# Altium schematic sheet BMS_MCU.SchDoc: MCU
size A2; CompanyName: TAISAT; DrawnBy: Alperen Fenerci; Organization: GREENGUARD; SheetNumber: 2; SheetTotal: 2
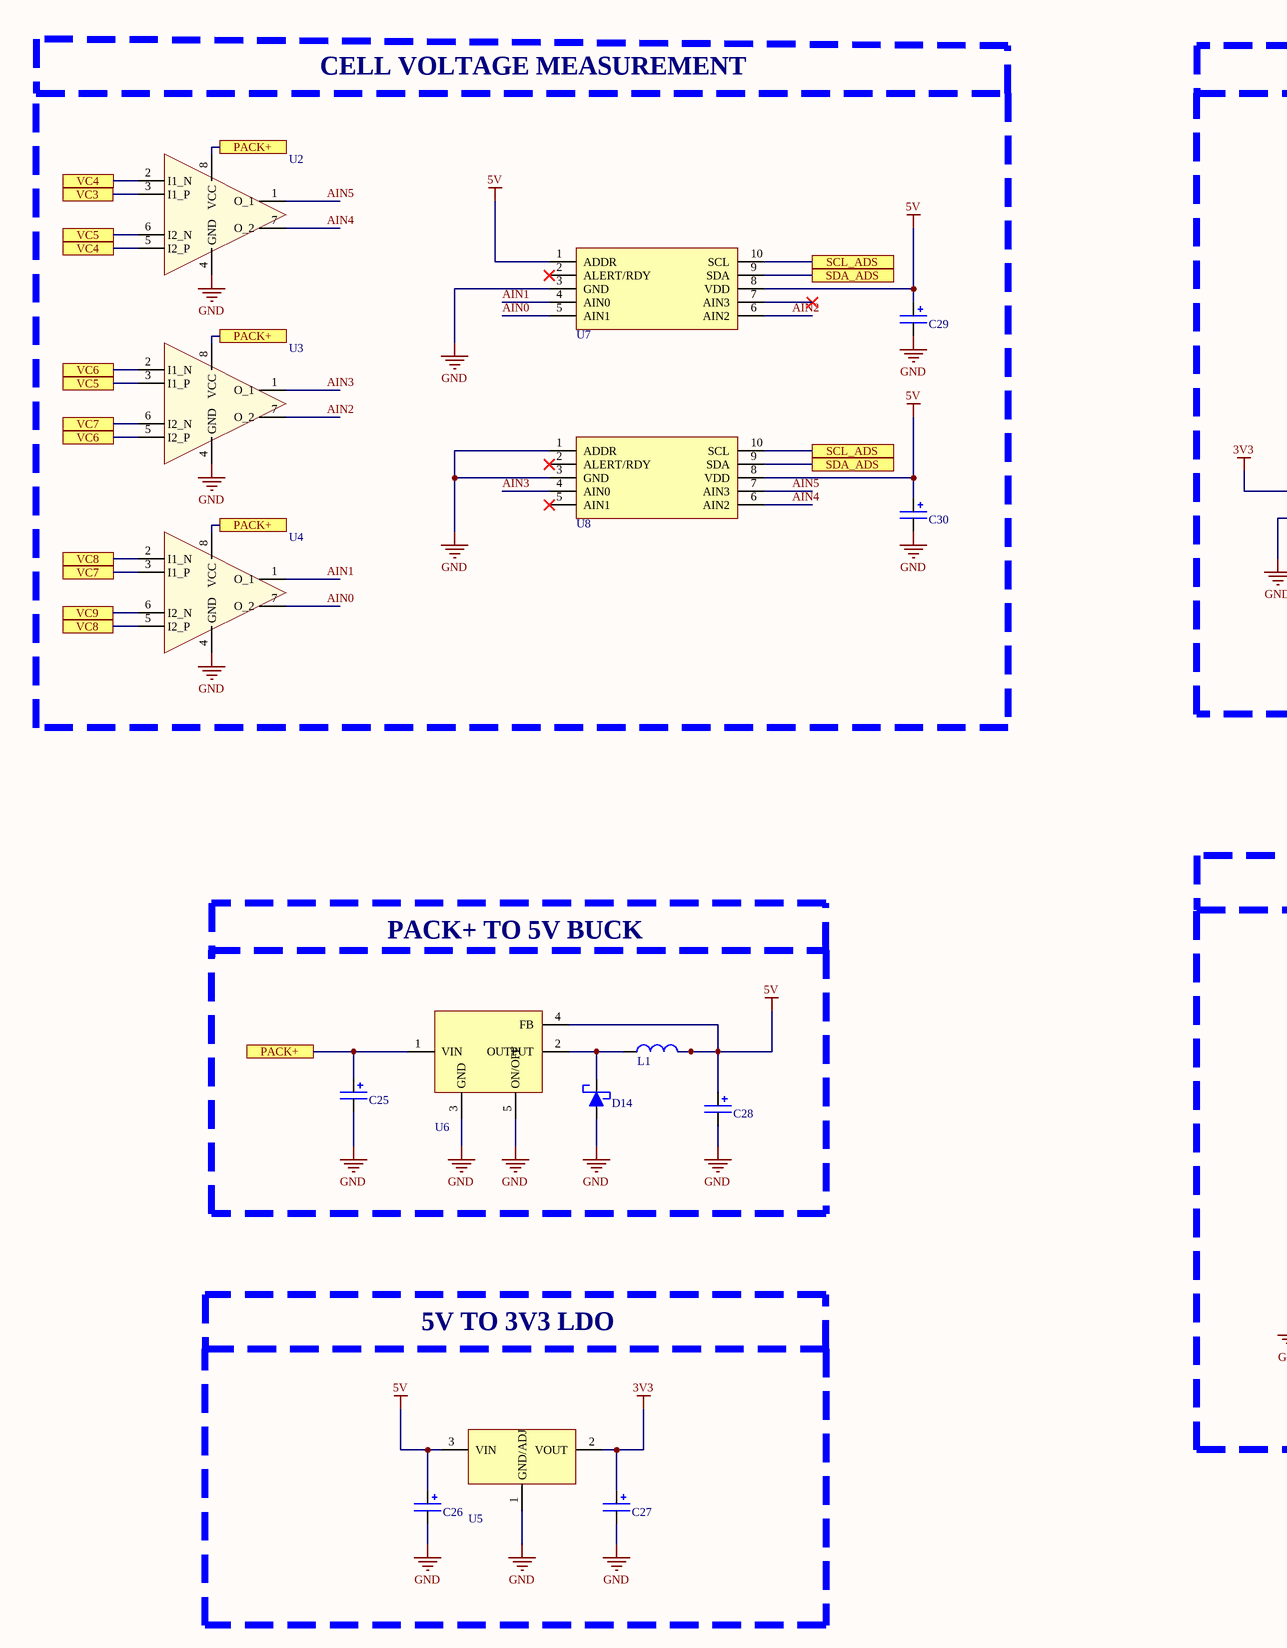
[diagram p0: BMS_MCU.SchDoc, left]
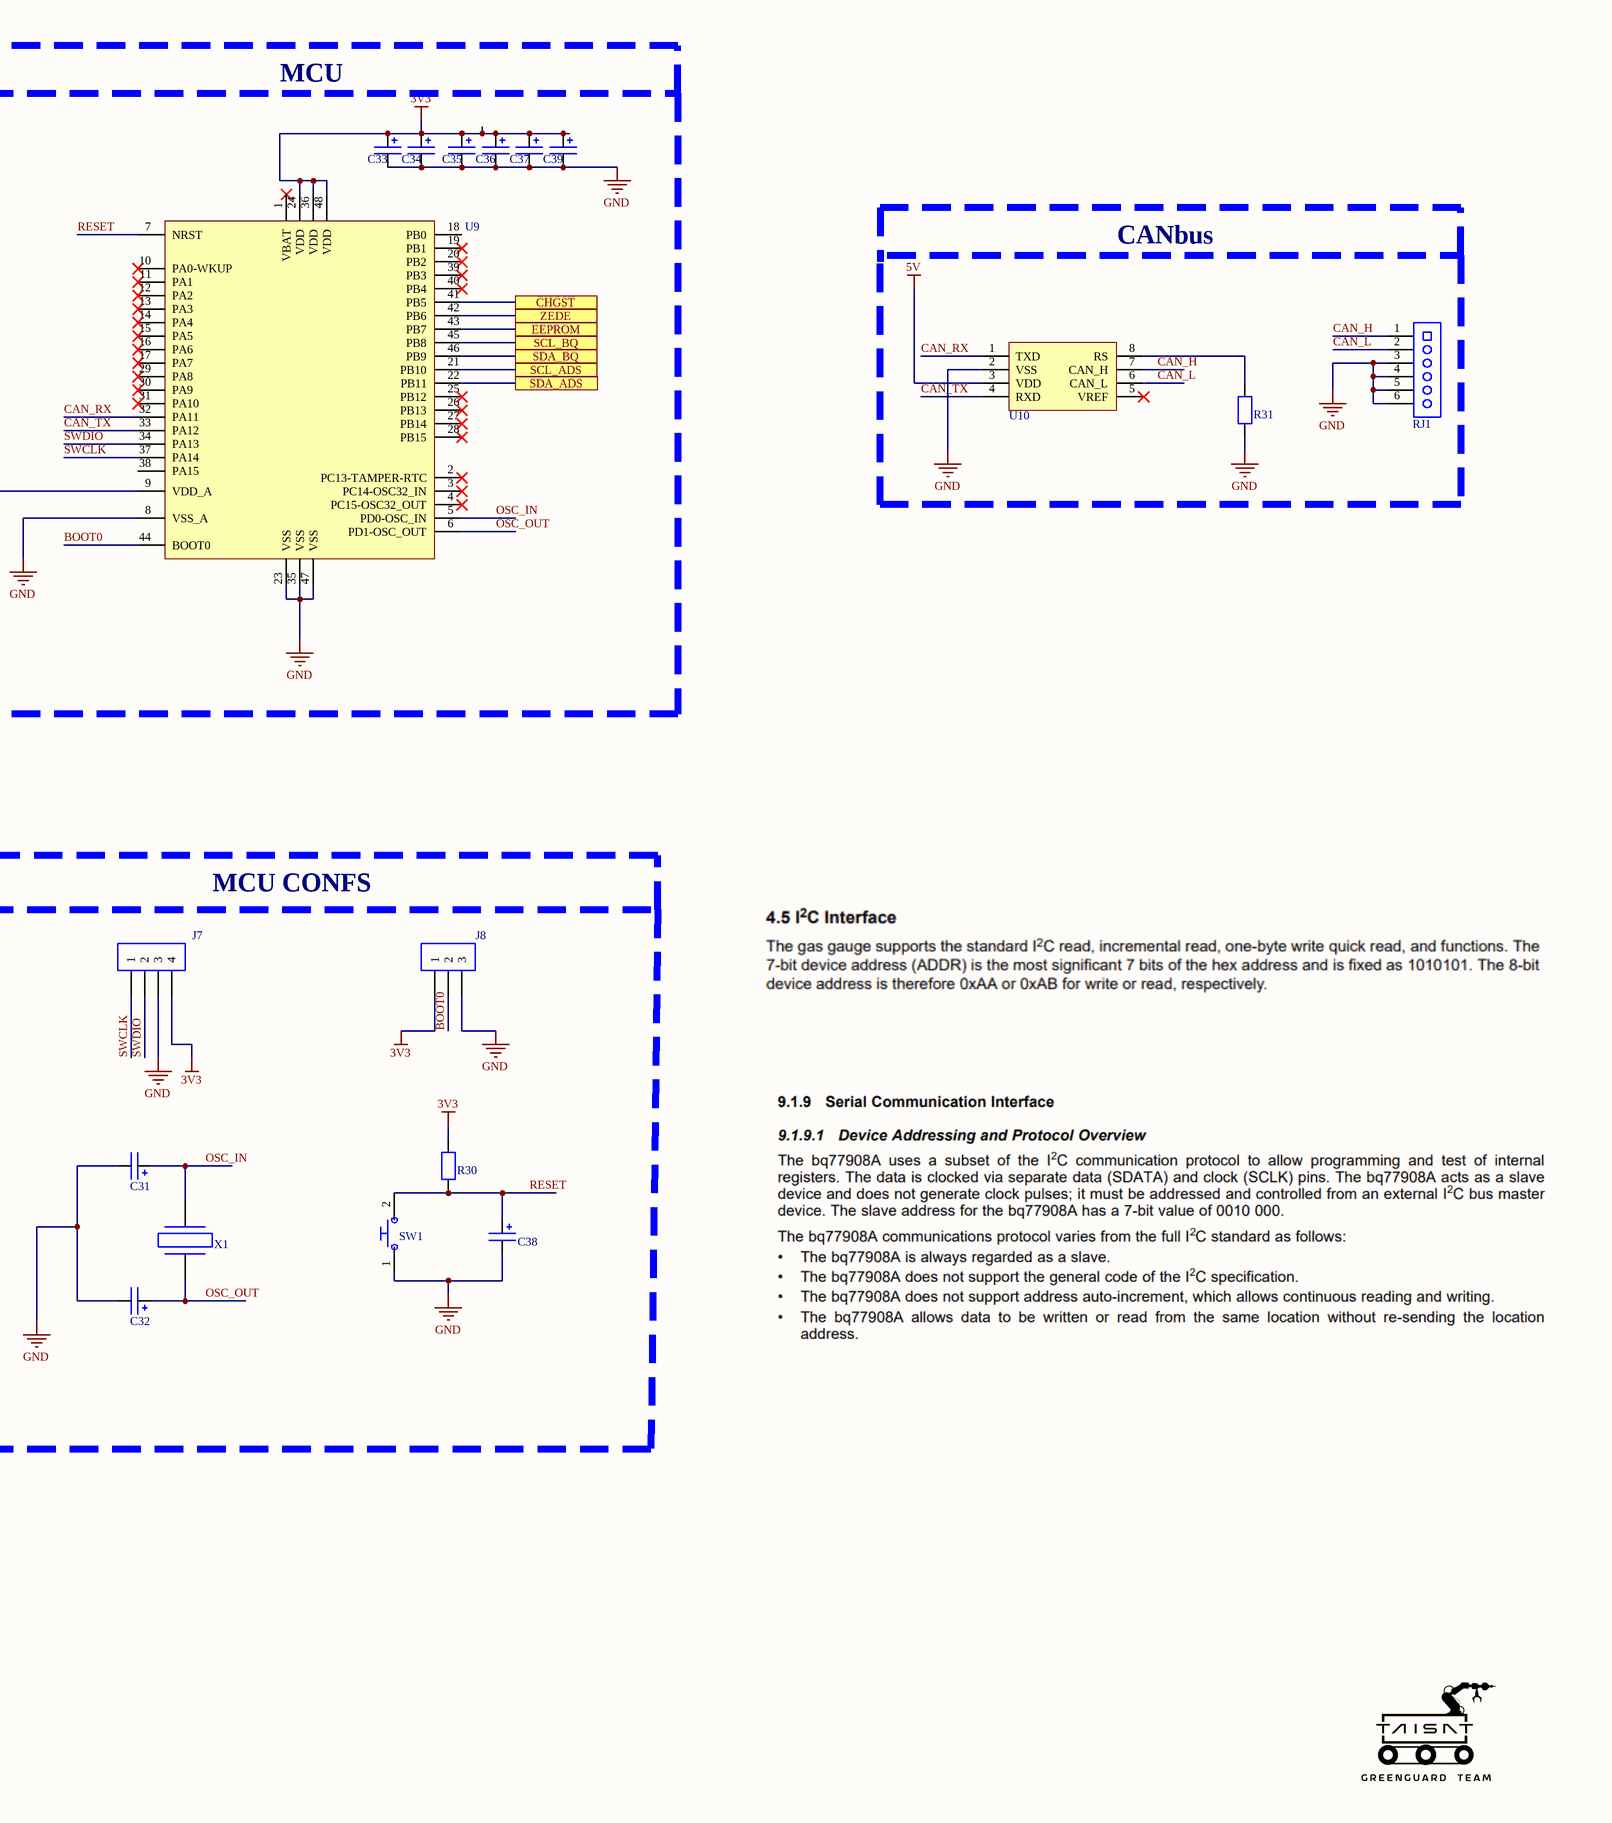
[diagram p1: BMS_MCU.SchDoc, right]

## Parts
C25  100uF  [CAP 0603]  (value not drawn)
C26  100nF  [CAP 0603]  (value not drawn)
C27  22uF  [CAP 0603]  (value not drawn)
C28  330uF  [CAP 0603]  (value not drawn)
C29  0.1uF  [CAP 0603]  (value not drawn)
C30  0.1uF  [CAP 0603]  (value not drawn)
C31  0.1uF  [CAP 0603]  (value not drawn)
C32  0.1uF  [CAP 0603]  (value not drawn)
C33  0.1uF  [CAP 0603]  (value not drawn)
C34  0.1uF  [CAP 0603]  (value not drawn)
C35  0.1uF  [CAP 0603]  (value not drawn)
C36  0.1uF  [CAP 0603]  (value not drawn)
C37  0.1uF  [CAP 0603]  (value not drawn)
C38  0.1uF  [CAP 0603]  (value not drawn)
C39  0.1uF  [CAP 0603]  (value not drawn)
D14  1N5819HW-7-F  [SOD123]  (value not drawn)
J7  146285-4  [HEADER 1x4]  (value not drawn)
J8  146285-3  [HEADER 1x3]  (value not drawn)
L1  330uH  [INDUCTOR SMD]  (value not drawn)
R30  1K  [RESISTOR 0603]  (value not drawn)
R31  10K  [RESISTOR 0603]  (value not drawn)
RJ1  DS1133-03-S60BX  [RJ11,RJ12,RJ14,RJ25]  (value not drawn)
SW1  DTSMF-31R  [SWITCH 6.00 x 3.5 - 2]  (value not drawn)
U2  TL3472CDR  [SOIC-8]  (value not drawn)
U3  TL3472CDR  [SOIC-8]  (value not drawn)
U4  TL3472CDR  [SOIC-8]  (value not drawn)
U5  AMS1117-3V3  [SOT223-3]  (value not drawn)
U6  LM2575-5V  [D2PAK-5]  (value not drawn)
U7  ADS1015  [VSSOP-10]  (value not drawn)
U8  ADS1015  [VSSOP-10]  (value not drawn)
U9  STM32F103x8  [LQFP48]  (value not drawn)
U10  MCP2551T-I  [SOIC-8]  (value not drawn)
X1  CRYSTAL  [CRYSTAL THT]  (value not drawn)

## Ports
CHGST (see BMS_Cell[4B]), EEPROM (see BMS_Cell[5B]), PACK+ (see BMS_Cell[2A], BMS_Cell[4A], BMS_Cell[7C], BMS_Cell[7D], BMS_MCU[1A], BMS_MCU[1B]), PACK+ (see BMS_Cell[2A], BMS_Cell[4A], BMS_Cell[7C], BMS_Cell[7D], BMS_MCU[1A], BMS_MCU[1B], BMS_MCU[1C]), PACK+ (see BMS_Cell[2A], BMS_Cell[4A], BMS_Cell[7C], BMS_Cell[7D], BMS_MCU[1A], BMS_MCU[1C]), SCL_ADS (see BMS_MCU[3A], BMS_MCU[3B]), SCL_ADS (see BMS_MCU[3A], BMS_MCU[6A]), SCL_ADS (see BMS_MCU[3B], BMS_MCU[6A]), SCL_BQ (see BMS_Cell[5B]), SDA_ADS (see BMS_MCU[3A], BMS_MCU[3B]), SDA_ADS (see BMS_MCU[3A], BMS_MCU[6A]), SDA_ADS (see BMS_MCU[3B], BMS_MCU[6A]), SDA_BQ (see BMS_Cell[5B]), VC3 (see BMS_Cell[3A]), VC4 (see BMS_Cell[3A], BMS_MCU[1A]), VC5 (see BMS_Cell[3A], BMS_MCU[1A]), VC6 (see BMS_Cell[3A], BMS_MCU[1A]), VC6 (see BMS_Cell[3A], BMS_MCU[1B]), VC7 (see BMS_Cell[3A], BMS_MCU[1B]), VC8 (see BMS_Cell[3A], BMS_MCU[1B]), VC9 (see BMS_Cell[2B]), ZEDE (see BMS_Cell[5B])

## Nets
3V3: C27.1 C33.1 C34.1 C35.1 C36.1 C37.1 C39.1 J7.4 J8.1 R30.2 U5.2(VOUT) U9.9(VDD_A) U9.24(VDD) U9.36(VDD) U9.48(VDD)
5V: C26.1 C28.1 C29.1 C30.1 L1.2 U5.3(VIN) U6.4(FB) U7.1(ADDR) U7.8(VDD) U8.8(VDD) U10.3(VDD)
GND: C25.2 C26.2 C27.2 C28.2 C29.2 C30.2 C31.2 C32.2 C33.2 C34.2 C35.2 C36.2 C37.2 C38.2 C39.2 D14.2 J7.3 J8.3 R31.1 RJ1.3 RJ1.4 RJ1.5 RJ1.6 SW1.1 U2.4(GND) U3.4(GND) U4.4(GND) U5.1(GND/ADJ) U6.3(GND) U6.5(ON/OFF) U7.3(GND) U8.1(ADDR) U8.3(GND) U9.8(VSS_A) U9.23(VSS) U9.35(VSS) U9.47(VSS) U10.2(VSS)
AIN0: U4.7(O_2) U7.5(AIN1)
AIN1: U4.1(O_1) U7.4(AIN0)
AIN2: U3.7(O_2) U7.6(AIN2)
AIN3: U3.1(O_1) U8.4(AIN0)
AIN4: U2.7(O_2) U8.6(AIN2)
AIN5: U2.1(O_1) U8.7(AIN3)
BOOT0: J8.2 U9.44(BOOT0)
CAN_H: RJ1.1 U10.7(CAN_H)
CAN_L: RJ1.2 U10.6(CAN_L)
CAN_RX: U9.32(PA11) U10.1(TXD)
CAN_TX: U9.33(PA12) U10.4(RXD)
CHGST: U9.41(PB5) ; port CHGST
EEPROM: U9.43(PB7) ; port EEPROM
OSC_IN: C31.1 U9.5(PD0-OSC_IN) X1.1
OSC_OUT: C32.1 U9.6(PD1-OSC_OUT) X1.2
PACK+: C25.1 U2.8(VCC) U3.8(VCC) U4.8(VCC) U6.1(VIN) ; port PACK+
RESET: C38.1 R30.1 SW1.2 U9.7(NRST)
SCL_ADS: U7.10(SCL) U8.10(SCL) U9.21(PB10) ; port SCL_ADS
SCL_BQ: U9.45(PB8) ; port SCL_BQ
SDA_ADS: U7.9(SDA) U8.9(SDA) U9.22(PB11) ; port SDA_ADS
SDA_BQ: U9.46(PB9) ; port SDA_BQ
SWCLK: J7.1 U9.37(PA14)
SWDIO: J7.2 U9.34(PA13)
VC3: U2.3(I1_P) ; port VC3
VC4: U2.2(I1_N) U2.5(I2_P) ; port VC4
VC5: U2.6(I2_N) U3.3(I1_P) ; port VC5
VC6: U3.2(I1_N) U3.5(I2_P) ; port VC6
VC7: U3.6(I2_N) U4.3(I1_P) ; port VC7
VC8: U4.2(I1_N) U4.5(I2_P) ; port VC8
VC9: U4.6(I2_N) ; port VC9
ZEDE: U9.42(PB6) ; port ZEDE
NetD14_1: D14.1 L1.1 U6.2(OUTPUT)
NetR31_2: R31.2 U10.8(RS)

Not connected (* = marked no-connect by the designer): U7 2(ALERT/RDY)* 7(AIN3)*; U8 2(ALERT/RDY)* 5(AIN1)*; U9 1(VBAT)* 2(PC13-TAMPER-RTC)* 3(PC14-OSC32_IN)* 4(PC15-OSC32_OUT)* 10(PA0-WKUP)* 11(PA1)* 12(PA2)* 13(PA3)* 14(PA4)* 15(PA5)* 16(PA6)* 17(PA7)* 18(PB0) 19(PB1)* 20(PB2)* 25(PB12)* 26(PB13)* 27(PB14)* 28(PB15)* 29(PA8)* 30(PA9)* 31(PA10)* 38(PA15) 39(PB3)* 40(PB4)*; U10 5(VREF)*

## Notes on the sheet
- CELL VOLTAGE MEASUREMENT
- MCU
- CANbus
- PACK+ TO 5V BUCK
- MCU CONFS
- 5V TO 3V3 LDO
- Proje Adı / Project Name
- Dosya Adı / File Name
- Sayfa Adı / Sheet Name
- Şirket Adı / Company Name
- Tasarlayan / Designed By
- Takım / Team
- Kontrol Eden / Checked By
- Başlangıç Tarihi / Start Date
- Revize Tarihi / Revision Date
- Onaylayan / Approved By
- Sayfa / Sheet

## Library data of the parts
C25-C39 = CAP 0603: Multilayer Ceramic Capacitor; Manufacturer: KEMET; Manufacturer Part Number: C0603C103K5RACTU; Material: 4241ConductorMaterial; Value: 10nF; Tolerance: 10%; Voltage Rating: 50V; Dielectric: X7R; Dissipation Factor: 2.5%; Temperature Coefficient: 30ppm/°C; Supplier: Mouser; Supplier Part Number: 80-C0603C103K5R; RoHS: Yes; Category: Ceramic Capacitors; Stock: 1110922; Pricing: 1=0.1, 10=0.047, 50=0.047, 100=0.026, 1000=0.017, 10000=0.012 (USD); Mounting Technology: PCB,Surface Mount; Case/Package: 0603; Pins: 2; Case Code (Metric): 1608; Case Code (Imperial): 0603; Min Operating Temperature: -55°C; Max Operating Temperature: 125°C; Voltage Rating (DC): 50V; Packaging: Tape and Reel; Package Quantity: 4000; Termination: SMD/SMT; Series: C0603C; Construction: Flat; Voltage: 50V; Length: 1.6mm; Width: 0.8mm; Height: 0.8mm; Depth: 0.8mm; Lead Pitch: 0.7mm; Radiation Hardening: No; RoHS Compliant: Yes; Reach SVHC Compliant: No; Lead Free: 5697LeadFree; Created By: Kaptanyum
D14 = 1N5819HW-7-F: Diode Schottky 40V; Manufacturer: Diodes; Forward Current: 1A; Max Reverse Current: 50uA; Peak Non-Repetitive Surge Current: 25A; Forward Voltage: 450mV; Polarity: Standard; Max Power Dissipation: 450mW; Supplier: Future Electronics; Supplier Part Number: 5349287; Manufacturer Part Number: 1N5819HW-7-F; RoHS: Yes; Category: Rectifier Diodes; Stock: 3234000; Pricing: 3000=0.0539, 12000=0.0516, 30000=0.0488, 45000=0.0495, 75000=0.0487, 120000=0.0453, 150000=0.0462 (USD); Case/Package: SOD-123-2; Pins: 2; Weight: 0.000353oz; Min Operating Temperature: -65°C; Max Operating Temperature: 125°C; Max Repetitive Reverse Voltage (Vrrm): 40V; Package Quantity: 3000; Packaging: Tape and Reel; Average Rectified Current: 1A; Max Forward Surge Current (Ifsm): 25A; Termination: SMD/SMT; Voltage Rating (DC): 40V; Current Rating: 1A; Output Current: 1A; Max Reverse Voltage (DC): 40V; Series: -; Reverse Voltage: 40V; Length: 2.85mm; Width: 1.7mm; Height: 1.25mm; Radiation Hardening: No; RoHS Compliant: Yes; Lead Free: Lead Free; Reach SVHC Compliant: No; ComponentLink1URL: https://datasheet.ciiva.com/27092/1538419-27092484.pdf?src-supplier=Jameco; ComponentLink1Description: https://datasheet.ciiva.com/27092/1538419-27092484.pdf?src-supplier=Jameco; ComponentLink2URL: https://datasheet.ciiva.com/16303/ds30217-16303296.pdf?src-supplier=Future+Electronics; ComponentLink2Description: https://datasheet.ciiva.com/16303/ds30217-16303296.pdf?src-supplier=Future+Electronics; ComponentLink3URL: https://datasheet.ciiva.com/8303/ds30217-8303132.pdf?src-supplier=Avnet; ComponentLink3Description: https://datasheet.ciiva.com/8303/ds30217-8303132.pdf?src-supplier=Avnet; ComponentLink4URL: https://datasheet.ciiva.com/912/ds30217-912802.pdf?src-supplier=Digi-Key; ComponentLink4Description: https://datasheet.ciiva.com/912/ds30217-912802.pdf?src-supplier=Digi-Key; ComponentLink5URL: https://datasheet.ciiva.com/912/ds30217-912803.pdf?src-supplier=Digi-Key; ComponentLink5Description: https://datasheet.ciiva.com/912/ds30217-912803.pdf?src-supplier=Digi-Key; ComponentLink6URL: https://datasheet.ciiva.com/912/ds30217-912801.pdf?src-supplier=Digi-Key; ComponentLink6Description: https://datasheet.ciiva.com/912/ds30217-912801.pdf?src-supplier=Digi-Key; ComponentLink7URL: https://datasheet.ciiva.com/1177/ds30217-1177089.pdf?src-supplier=Element14; ComponentLink7Description: https://datasheet.ciiva.com/1177/ds30217-1177089.pdf?src-supplier=Element14; Created By: Kaptanyum
J7 = HEADER 1x4: Header for PCB; Manufacturer: JST; Manufacturer Part Number: B4B-XH-A(LF)(SN); Gender: Male; Contact Resistance: 20mR; Max Current Rating: 3A; Voltage Rating: 250V; Number of Positions: 4; Insulation Resistance: 1GR; Pitch: 2.5mm; Mated Stacking Heights: 9.8mm; Wire/Cable Gauge: 22AWG; Supplier: Arrow Electronics; Supplier Part Number: B4B-XH-A(LF)(SN); RoHS: Yes; Category: Headers and Wire Housings; Stock: 46264; Pricing: 1=0.1585, 10=0.1388, 25=0.1373, 50=0.1359, 100=0.0728 (USD); Mounting Technology: Through Hole; Contact Plating: Tin,Lead,Copper; Contact Material: Brass; Housing Color: White; Housing Material: Polyamide; Contact Shape: Square; Contact Finish - Mating: TIN; Insulation Material: Nylon; Insulation Color: Natural; Color: Natural; Material: Polyamide; Min Operating Temperature: -25°C; Max Operating Temperature: 85°C; Number of Rows: 1; Termination: Solder; Series: XH; Packaging: Bulk; Max Voltage Rating (AC): 250V; Number of Contacts: 4; Orientation: Straight; Connector Type: Header; Contact Type: Male Pin; Fastening Type: Detent; Current Rating: 3A; Voltage Rating (AC): 250V; Max Voltage Rating (DC): 250V; Length: 12.4mm; Depth: 5.75mm; Lead Pitch: 2.5mm; Reach SVHC Compliant: No; Lead Free: Lead Free; Flammability Rating: UL94 V-0; ComponentLink1URL: https://datasheet.ciiva.com/16203/b4b-xh-alfsn-16203642.pdf?src-supplier=Future+Electronics; ComponentLink1Description: https://datasheet.ciiva.com/16203/b4b-xh-alfsn-16203642.pdf?src-supplier=Future+Electronics; ComponentLink2URL: https://datasheet.ciiva.com/26894/getdatasheetpartid-455616-26894787.pdf?src-supplier=Verical; ComponentLink2Description: https://datasheet.ciiva.com/26894/getdatasheetpartid-455616-26894787.pdf?src-supplier=Verical; ComponentLink3URL: https://datasheet.ciiva.com/26924/getdatasheetpartid-640571-26924035.pdf?src-supplier=Verical; ComponentLink3Description: https://datasheet.ciiva.com/26924/getdatasheetpartid-640571-26924035.pdf?src-supplier=Verical; ComponentLink4URL: https://datasheet.ciiva.com/726/exh-726404.pdf?src-supplier=Digi-Key; ComponentLink4Description: https://datasheet.ciiva.com/726/exh-726404.pdf?src-supplier=Digi-Key; Created By: Kaptanyum
J8 = HEADER 1x3: Header for PCB; Manufacturer: JST; Manufacturer Part Number: B4B-XH-A(LF)(SN); Gender: Male; Contact Resistance: 20mR; Max Current Rating: 3A; Voltage Rating: 250V; Number of Positions: 4; Insulation Resistance: 1GR; Pitch: 2.5mm; Mated Stacking Heights: 9.8mm; Wire/Cable Gauge: 22AWG; Supplier: Arrow Electronics; Supplier Part Number: B4B-XH-A(LF)(SN); RoHS: Yes; Category: Headers and Wire Housings; Stock: 46264; Pricing: 1=0.1585, 10=0.1388, 25=0.1373, 50=0.1359, 100=0.0728 (USD); Mounting Technology: Through Hole; Contact Plating: Tin,Lead,Copper; Contact Material: Brass; Housing Color: White; Housing Material: Polyamide; Contact Shape: Square; Contact Finish - Mating: TIN; Insulation Material: Nylon; Insulation Color: Natural; Color: Natural; Material: Polyamide; Min Operating Temperature: -25°C; Max Operating Temperature: 85°C; Number of Rows: 1; Termination: Solder; Series: XH; Packaging: Bulk; Max Voltage Rating (AC): 250V; Number of Contacts: 4; Orientation: Straight; Connector Type: Header; Contact Type: Male Pin; Fastening Type: Detent; Current Rating: 3A; Voltage Rating (AC): 250V; Max Voltage Rating (DC): 250V; Length: 12.4mm; Depth: 5.75mm; Lead Pitch: 2.5mm; Reach SVHC Compliant: No; Lead Free: Lead Free; Flammability Rating: UL94 V-0; ComponentLink1URL: https://datasheet.ciiva.com/16203/b4b-xh-alfsn-16203642.pdf?src-supplier=Future+Electronics; ComponentLink1Description: https://datasheet.ciiva.com/16203/b4b-xh-alfsn-16203642.pdf?src-supplier=Future+Electronics; ComponentLink2URL: https://datasheet.ciiva.com/26894/getdatasheetpartid-455616-26894787.pdf?src-supplier=Verical; ComponentLink2Description: https://datasheet.ciiva.com/26894/getdatasheetpartid-455616-26894787.pdf?src-supplier=Verical; ComponentLink3URL: https://datasheet.ciiva.com/26924/getdatasheetpartid-640571-26924035.pdf?src-supplier=Verical; ComponentLink3Description: https://datasheet.ciiva.com/26924/getdatasheetpartid-640571-26924035.pdf?src-supplier=Verical; ComponentLink4URL: https://datasheet.ciiva.com/726/exh-726404.pdf?src-supplier=Digi-Key; ComponentLink4Description: https://datasheet.ciiva.com/726/exh-726404.pdf?src-supplier=Digi-Key; Created By: Kaptanyum
L1 = INDUCTOR SMD: Inductor Power Shielded Wirewound; Manufacturer: Bourns; Manufacturer Part Number: SRR1260-330M; Value: 33uH; Self Resonant Frequency: 9.97MHz; RMS Current (Irms): 3A; Saturation Current: 2.8A; Inductance Tolerance: 20%; Q Factor: 27NUMBER; Supplier: Arrow Electronics; Supplier Part Number: SRR1260-330M; RoHS: Yes; Category: Fixed Inductors; Stock: 16200; Pricing: 600=0.4391, 1200=0.4292 (USD); Pins: 2NUMBER; Min Operating Temperature: -40°C; Max Operating Temperature: 125°C; Packaging: 10Packaging; Current Rating: 3A; RoHS Compliant: Yes; ComponentLink1URL: http://www.farnell.com/datasheets/2251090.pdf?src-supplier=Farnell; ComponentLink1Description: http://www.farnell.com/datasheets/2251090.pdf?src-supplier=Farnell; Created By: Kaptanyum
R30 R31 = RES 0603: SMD Chip Resistor; Manufacturer: Yageo; Manufacturer Part Number: AC0603FR-071KL; Tolerance: 1%; Value: 1kR; Power Rating: 100mW; Voltage Rating: 50V; Temperature Coefficient: 100ppm/°C; Supplier: Future Electronics; Supplier Part Number: 1029290; RoHS: Yes; Category: Chip SMD Resistors; Stock: 1025000; Pricing: 5000=0.0021, 25000=0.0019, 150000=0.0018, 500000=0.0017, 1500000=0.0016 (USD); Case/Package: 0603; Case Code (Metric): 1608; Case Code (Imperial): 0603; Min Operating Temperature: -55°C; Max Operating Temperature: 155°C; Packaging: Tape and Reel; Package Quantity: 1; Number of Terminations: 2; Termination: SMD/SMT; Max Power Dissipation: 100mW; Features: Moisture Resistant,Automotive AEC-Q200,Anti-Sulfur; Series: AC; Length: 0.063inch; Width: 0.031inch; Height: 0.022inch; Ratings: AEC-Q200; Lead Free: Lead Free; RoHS Compliant: Yes; ComponentLink1URL: https://datasheet.ciiva.com/5558/pyu-ac-51-rohs-l-2-5558269.pdf?src-supplier=Mouser; ComponentLink1Description: https://datasheet.ciiva.com/5558/pyu-ac-51-rohs-l-2-5558269.pdf?src-supplier=Mouser; Created By: Kaptanyum
RJ1 = RJ14 SOCKET: 6P6C RJ11, RJ12, RJ14, RJ25
SW1 = DTSMF-31R: Switch 6mm x 3.5mm
U2-U4 = TL3472CDR: Op-Amp Gen 2-ch
U5 = AMS1117-3V3: Linear Voltage Regulator; Created By: Kaptanyum
U6 = LM2575-5V: Buck Regulator; Manufacturer: TI National Semiconductor; Manufacturer Part Number: LM2575SX-5.0/NOPB; Output Current: 1A; Efficiency: 77%; Min Input Voltage: 4V; Output Voltage: 5V; Number of Outputs: 1; Max Supply Voltage: 40V; Switching Frequency: 52kHz; Synchronous Rectifier: No; Quiescent Current: 10mA; Output Type: Fixed; Supplier: Digi-Key; Supplier Part Number: LM2575SX-5.0/NOPBDKR-ND; RoHS: Yes; Category: Voltage Regulators - Switching; Pricing: 1=4.18, 10=3.752, 25=3.5472, 100=3.0744, 250=2.91672 (USD); Mounting Technology: Surface Mount; Case/Package: TO-263-6; Pins: 5; Min Operating Temperature: -40°C; Max Operating Temperature: 125°C; Packaging: Tape and Reel; Nominal Output Voltage: 5V; Series: SIMPLE SWITCHER®; Reach SVHC Compliant: No; Lead Free: Contains Lead; RoHS Compliant: Yes; ComponentLink1URL: https://datasheet.ciiva.com/30513/1289299-30513966.pdf?src-supplier=Jameco; ComponentLink1Description: https://datasheet.ciiva.com/30513/1289299-30513966.pdf?src-supplier=Jameco; ComponentLink2URL: https://datasheet.ciiva.com/41457/001013723-da-01-en-ic-reg-bu-lm2575sx-5-0-nopb-to-263-5-tid-41457574.pdf?src-supplier=Conrad; ComponentLink2Description: https://datasheet.ciiva.com/41457/001013723-da-01-en-ic-reg-bu-lm2575sx-5-0-nopb-to-263-5-tid-41457574.pdf?src-supplier=Conrad; ComponentLink3URL: https://datasheet.ciiva.com/6606/lm1575-6606205.pdf?src-supplier=Digi-Key; ComponentLink3Description: https://datasheet.ciiva.com/6606/lm1575-6606205.pdf?src-supplier=Digi-Key; ComponentLink4URL: https://datasheet.ciiva.com/6606/lm1575-6606150.pdf?src-supplier=Digi-Key; ComponentLink4Description: https://datasheet.ciiva.com/6606/lm1575-6606150.pdf?src-supplier=Digi-Key; ComponentLink5URL: https://datasheet.ciiva.com/6606/lm1575-6606201.pdf?src-supplier=Digi-Key; ComponentLink5Description: https://datasheet.ciiva.com/6606/lm1575-6606201.pdf?src-supplier=Digi-Key; Created By: Kaptanyum
U7 U8 = ADS1015: Quad Channel Single ADC; Manufacturer: Texas Instruments; Manufacturer Part Number: ADS1015IDGST; Interface: I2C; Number of Bits: 12; Sampling Rate: 3.3KS/s; Operating Supply Voltage: 3.3V; Number of A/D Converters: 1; Number of Inputs: 4; Resolution: 12b; Integral Nonlinearity (INL): 0.5LSB; Max Supply Voltage (DC): 5.5V; Min Supply Voltage (DC): 2V; Polarity: Bipolar; Conversion Rate: 3300S/s; Power Dissipation: 900uW; Supply Current: 150uA; Supplier: Mouser; Supplier Part Number: 595-ADS1015IDGST; RoHS: Yes; Category: Analog to Digital Converters (ADCs); Stock: 16249; Pricing: 1=3.53, 10=3, 50=3, 100=2.59, 1000=1.86, 10000=1.77 (USD); Case/Package: VSSOP; Pins: 10; Contact Plating: Gold; Min Operating Temperature: -40°C; Max Operating Temperature: 125°C; Packaging: Tape and Reel; Package Quantity: 1; Series: -; Number of Converters: 1; Supply Type: Single; Min Supply Voltage: 2V; Max Supply Voltage: 5.5V; Number of Elements: 1; Number of Channels: 4; Max Power Dissipation: 900uW; Termination: SMD/SMT; Length: 3mm; Width: 3mm; Height: 1.02mm; Radiation Hardening: No; RoHS Compliant: Yes; Lead Free: Lead Free; Reach SVHC Compliant: No; ComponentLink1URL: https://datasheet.ciiva.com/1595/ads1015-1595834.pdf?src-supplier=Newark; ComponentLink1Description: https://datasheet.ciiva.com/1595/ads1015-1595834.pdf?src-supplier=Newark; ComponentLink2URL: https://datasheet.ciiva.com/1704/1788973-1704263.pdf?src-supplier=Element14; ComponentLink2Description: https://datasheet.ciiva.com/1704/1788973-1704263.pdf?src-supplier=Element14; ComponentLink3URL: https://datasheet.ciiva.com/22696/1788973-22696408.pdf?src-supplier=Element14; ComponentLink3Description: https://datasheet.ciiva.com/22696/1788973-22696408.pdf?src-supplier=Element14; ComponentLink4URL: https://datasheet.ciiva.com/1303/ads1013-1303154.pdf?src-supplier=Digi-Key; ComponentLink4Description: https://datasheet.ciiva.com/1303/ads1013-1303154.pdf?src-supplier=Digi-Key; ComponentLink5URL: https://datasheet.ciiva.com/1303/ads1013-1303153.pdf?src-supplier=Digi-Key; ComponentLink5Description: https://datasheet.ciiva.com/1303/ads1013-1303153.pdf?src-supplier=Digi-Key; ComponentLink6URL: https://datasheet.ciiva.com/6666/ads1013-6666392.pdf?src-supplier=Digi-Key; ComponentLink6Description: https://datasheet.ciiva.com/6666/ads1013-6666392.pdf?src-supplier=Digi-Key; ComponentLink7URL: https://datasheet.ciiva.com/3038/sbas473c-3038712.pdf?src-supplier=Avnet; ComponentLink7Description: https://datasheet.ciiva.com/3038/sbas473c-3038712.pdf?src-supplier=Avnet; Created By: Kaptanyum
U9 = STM32F103x8: MCU 32-bit STM32F ARM Cortex M3; Manufacturer: STMicroelectronics; Manufacturer Part Number: STM32F103C6T6A; Number of Timers/Counters: 3; Max Supply Voltage: 3.6V; Interface: I2C,SPI,USART; RAM Size: 10KB; Number of I/Os: 37; Min Supply Voltage: 2V; Data Bus Width: 32b; Clock Frequency: 72MHz; Memory Format: FLASH; Memory Size: 32KB; Number of ADC Channels: 10; Supplier: Mouser; Supplier Part Number: 511-STM32F103C6T6A; RoHS: Yes; Category: Microcontrollers; Stock: 2889; Pricing: 1=6.08, 10=4.69, 50=4.69, 100=4.47, 1000=3.21, 10000=3.04 (USD); Case/Package: LQFP; Pins: 48; Weight: 0.006409oz; Min Operating Temperature: -40°C; Max Operating Temperature: 85°C; Package Quantity: 1500; Packaging: Tray; Core Architecture: ARM; Series: STM32F103C6; Length: 7mm; Width: 7mm; Height: 1.4mm; RoHS Compliant: Yes; Lead Free: Lead Free; ComponentLink1URL: https://datasheet.ciiva.com/15122/getdatasheetpartid-69879-15122075.pdf?src-supplier=Verical; ComponentLink1Description: https://datasheet.ciiva.com/15122/getdatasheetpartid-69879-15122075.pdf?src-supplier=Verical; ComponentLink2URL: https://datasheet.ciiva.com/14100/pustm-arm-microcont-stm32f103-en-14100507.pdf?src-supplier=Distrelec; ComponentLink2Description: https://datasheet.ciiva.com/14100/pustm-arm-microcont-stm32f103-en-14100507.pdf?src-supplier=Distrelec; Created By: Kaptanyum
U10 = MCP2551T-I: CAN Transceiver; Manufacturer: Microchip; Manufacturer Part Number: MCP2551T-E/SN; Supplier: Arrow Electronics; Supplier Part Number: MCP2551T-E/SN; RoHS: Yes; Category: Interface ICs; Stock: 440; Pricing: 1=1.574, 10=1.559, 25=1.496, 100=1.432, 250=1.369 (USD); ComponentLink1URL: https://datasheet.ciiva.com/1604/657417-1604797.pdf?src-supplier=Newark; ComponentLink1Description: https://datasheet.ciiva.com/1604/657417-1604797.pdf?src-supplier=Newark; ComponentLink2URL: https://datasheet.ciiva.com/1767/21667f-1767467.pdf?src-supplier=Digi-Key; ComponentLink2Description: https://datasheet.ciiva.com/1767/21667f-1767467.pdf?src-supplier=Digi-Key; ComponentLink3URL: https://datasheet.ciiva.com/29718/filehandler-aspxddocname-en011797-29718437.pdf?src-supplier=Digi-Key; ComponentLink3Description: https://datasheet.ciiva.com/29718/filehandler-aspxddocname-en011797-29718437.pdf?src-supplier=Digi-Key; ComponentLink4URL: https://datasheet.ciiva.com/29718/filehandler-aspxddocname-en011797-29718438.pdf?src-supplier=Digi-Key; ComponentLink4Description: https://datasheet.ciiva.com/29718/filehandler-aspxddocname-en011797-29718438.pdf?src-supplier=Digi-Key; ComponentLink5URL: https://datasheet.ciiva.com/16290/filehandler-aspxddocname-en011797-16290269.pdf?src-supplier=Future+Electronics; ComponentLink5Description: https://datasheet.ciiva.com/16290/filehandler-aspxddocname-en011797-16290269.pdf?src-supplier=Future+Electronics; ComponentLink6URL: https://datasheet.ciiva.com/16983/70048433-16983254.pdf?src-supplier=Allied+Electronics; ComponentLink6Description: https://datasheet.ciiva.com/16983/70048433-16983254.pdf?src-supplier=Allied+Electronics; Created By: Kaptanyum
X1 = CRYSTAL: 8 MHZ DIP